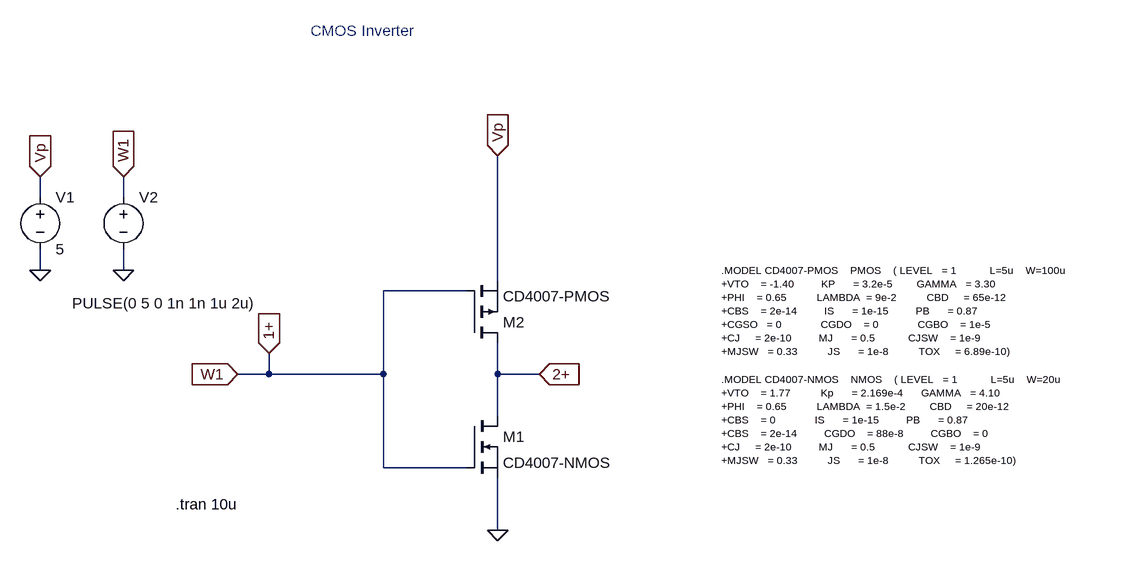
[diagram p0: schematic cmos_inv_ltspice.asc]
cmos_inv_ltspice.asc, the LTspice schematic file:
Version 4
SHEET 1 1416 680
WIRE -544 -224 -544 -256
WIRE -416 -224 -416 -256
WIRE -544 -112 -544 -144
WIRE -416 -112 -416 -144
WIRE 160 -96 160 -288
WIRE 112 -80 -16 -80
WIRE -192 48 -192 16
WIRE -192 48 -240 48
WIRE -16 48 -16 -80
WIRE -16 48 -192 48
WIRE 160 48 160 0
WIRE 224 48 160 48
WIRE 160 112 160 48
WIRE -16 192 -16 48
WIRE 112 192 -16 192
WIRE 160 288 160 208
FLAG -240 48 W1
IOPIN -240 48 In
FLAG 224 48 2+
IOPIN 224 48 In
FLAG 160 -288 Vp
IOPIN 160 -288 In
FLAG 160 288 0
FLAG -544 -112 0
FLAG -416 -112 0
FLAG -544 -256 Vp
IOPIN -544 -256 In
FLAG -416 -256 W1
IOPIN -416 -256 In
FLAG -192 16 1+
IOPIN -192 16 In
SYMBOL nmos 112 112 R0
SYMATTR InstName M1
SYMATTR Value CD4007-NMOS
SYMBOL pmos 112 0 M180
SYMATTR InstName M2
SYMATTR Value CD4007-PMOS
SYMBOL voltage -544 -240 R0
WINDOW 123 0 0 Left 0
WINDOW 39 0 0 Left 0
SYMATTR InstName V1
SYMATTR Value 5
SYMBOL voltage -416 -240 R0
WINDOW 3 -79 179 Left 2
WINDOW 123 0 0 Left 0
WINDOW 39 0 0 Left 0
SYMATTR Value PULSE(0 5 0 1n 1n 1u 2u)
SYMATTR InstName V2
TEXT 504 -112 Left 1 !.MODEL CD4007-PMOS    PMOS    ( LEVEL   = 1           L=5u    W=100u                \n+VTO    = -1.40         KP      = 3.2e-5        GAMMA   = 3.30  \n+PHI    = 0.65          LAMBDA  = 9e-2          CBD     = 65e-12\n+CBS    = 2e-14         IS      = 1e-15         PB      = 0.87\n+CGSO   = 0             CGDO    = 0             CGBO    = 1e-5\n+CJ     = 2e-10         MJ      = 0.5           CJSW    = 1e-9\n+MJSW   = 0.33          JS      = 1e-8          TOX     = 6.89e-10)
TEXT 504 56 Left 1 !.MODEL CD4007-NMOS    NMOS    ( LEVEL   = 1           L=5u    W=20u             \n+VTO    = 1.77          Kp      = 2.169e-4      GAMMA   = 4.10  \n+PHI    = 0.65          LAMBDA  = 1.5e-2        CBD     = 20e-12\n+CBS    = 0             IS      = 1e-15         PB      = 0.87\n+CBS    = 2e-14         CGDO    = 88e-8         CGBO    = 0\n+CJ     = 2e-10         MJ      = 0.5           CJSW    = 1e-9\n+MJSW   = 0.33          JS      = 1e-8          TOX     = 1.265e-10)
TEXT -336 248 Left 2 !.tran 10u
TEXT -128 -480 Left 2 ;CMOS Inverter

The netlist it stands for:
* cmos_inv_ltspice.asc
M1 2+ 1+ 0 0 CD4007-NMOS
M2 2+ 1+ Vp Vp CD4007-PMOS
V1 Vp 0 5
V2 1+ 0 PULSE(0 5 0 1n 1n 1u 2u)
.model NMOS NMOS
.model PMOS PMOS
.lib standard.mos
.MODEL CD4007-PMOS    PMOS    ( LEVEL   = 1           L=5u    W=100u
+VTO    = -1.40         KP      = 3.2e-5        GAMMA   = 3.30
+PHI    = 0.65          LAMBDA  = 9e-2          CBD     = 65e-12
+CBS    = 2e-14         IS      = 1e-15         PB      = 0.87
+CGSO   = 0             CGDO    = 0             CGBO    = 1e-5
+CJ     = 2e-10         MJ      = 0.5           CJSW    = 1e-9
+MJSW   = 0.33          JS      = 1e-8          TOX     = 6.89e-10)
.MODEL CD4007-NMOS    NMOS    ( LEVEL   = 1           L=5u    W=20u
+VTO    = 1.77          Kp      = 2.169e-4      GAMMA   = 4.10
+PHI    = 0.65          LAMBDA  = 1.5e-2        CBD     = 20e-12
+CBS    = 0             IS      = 1e-15         PB      = 0.87
+CBS    = 2e-14         CGDO    = 88e-8         CGBO    = 0
+CJ     = 2e-10         MJ      = 0.5           CJSW    = 1e-9
+MJSW   = 0.33          JS      = 1e-8          TOX     = 1.265e-10)
.tran 10u
* CMOS Inverter
.backanno
.end